# Altium schematic sheet BTB Mezzanine.SchDoc
size A3; SheetNumber: 2; SheetTotal: 11
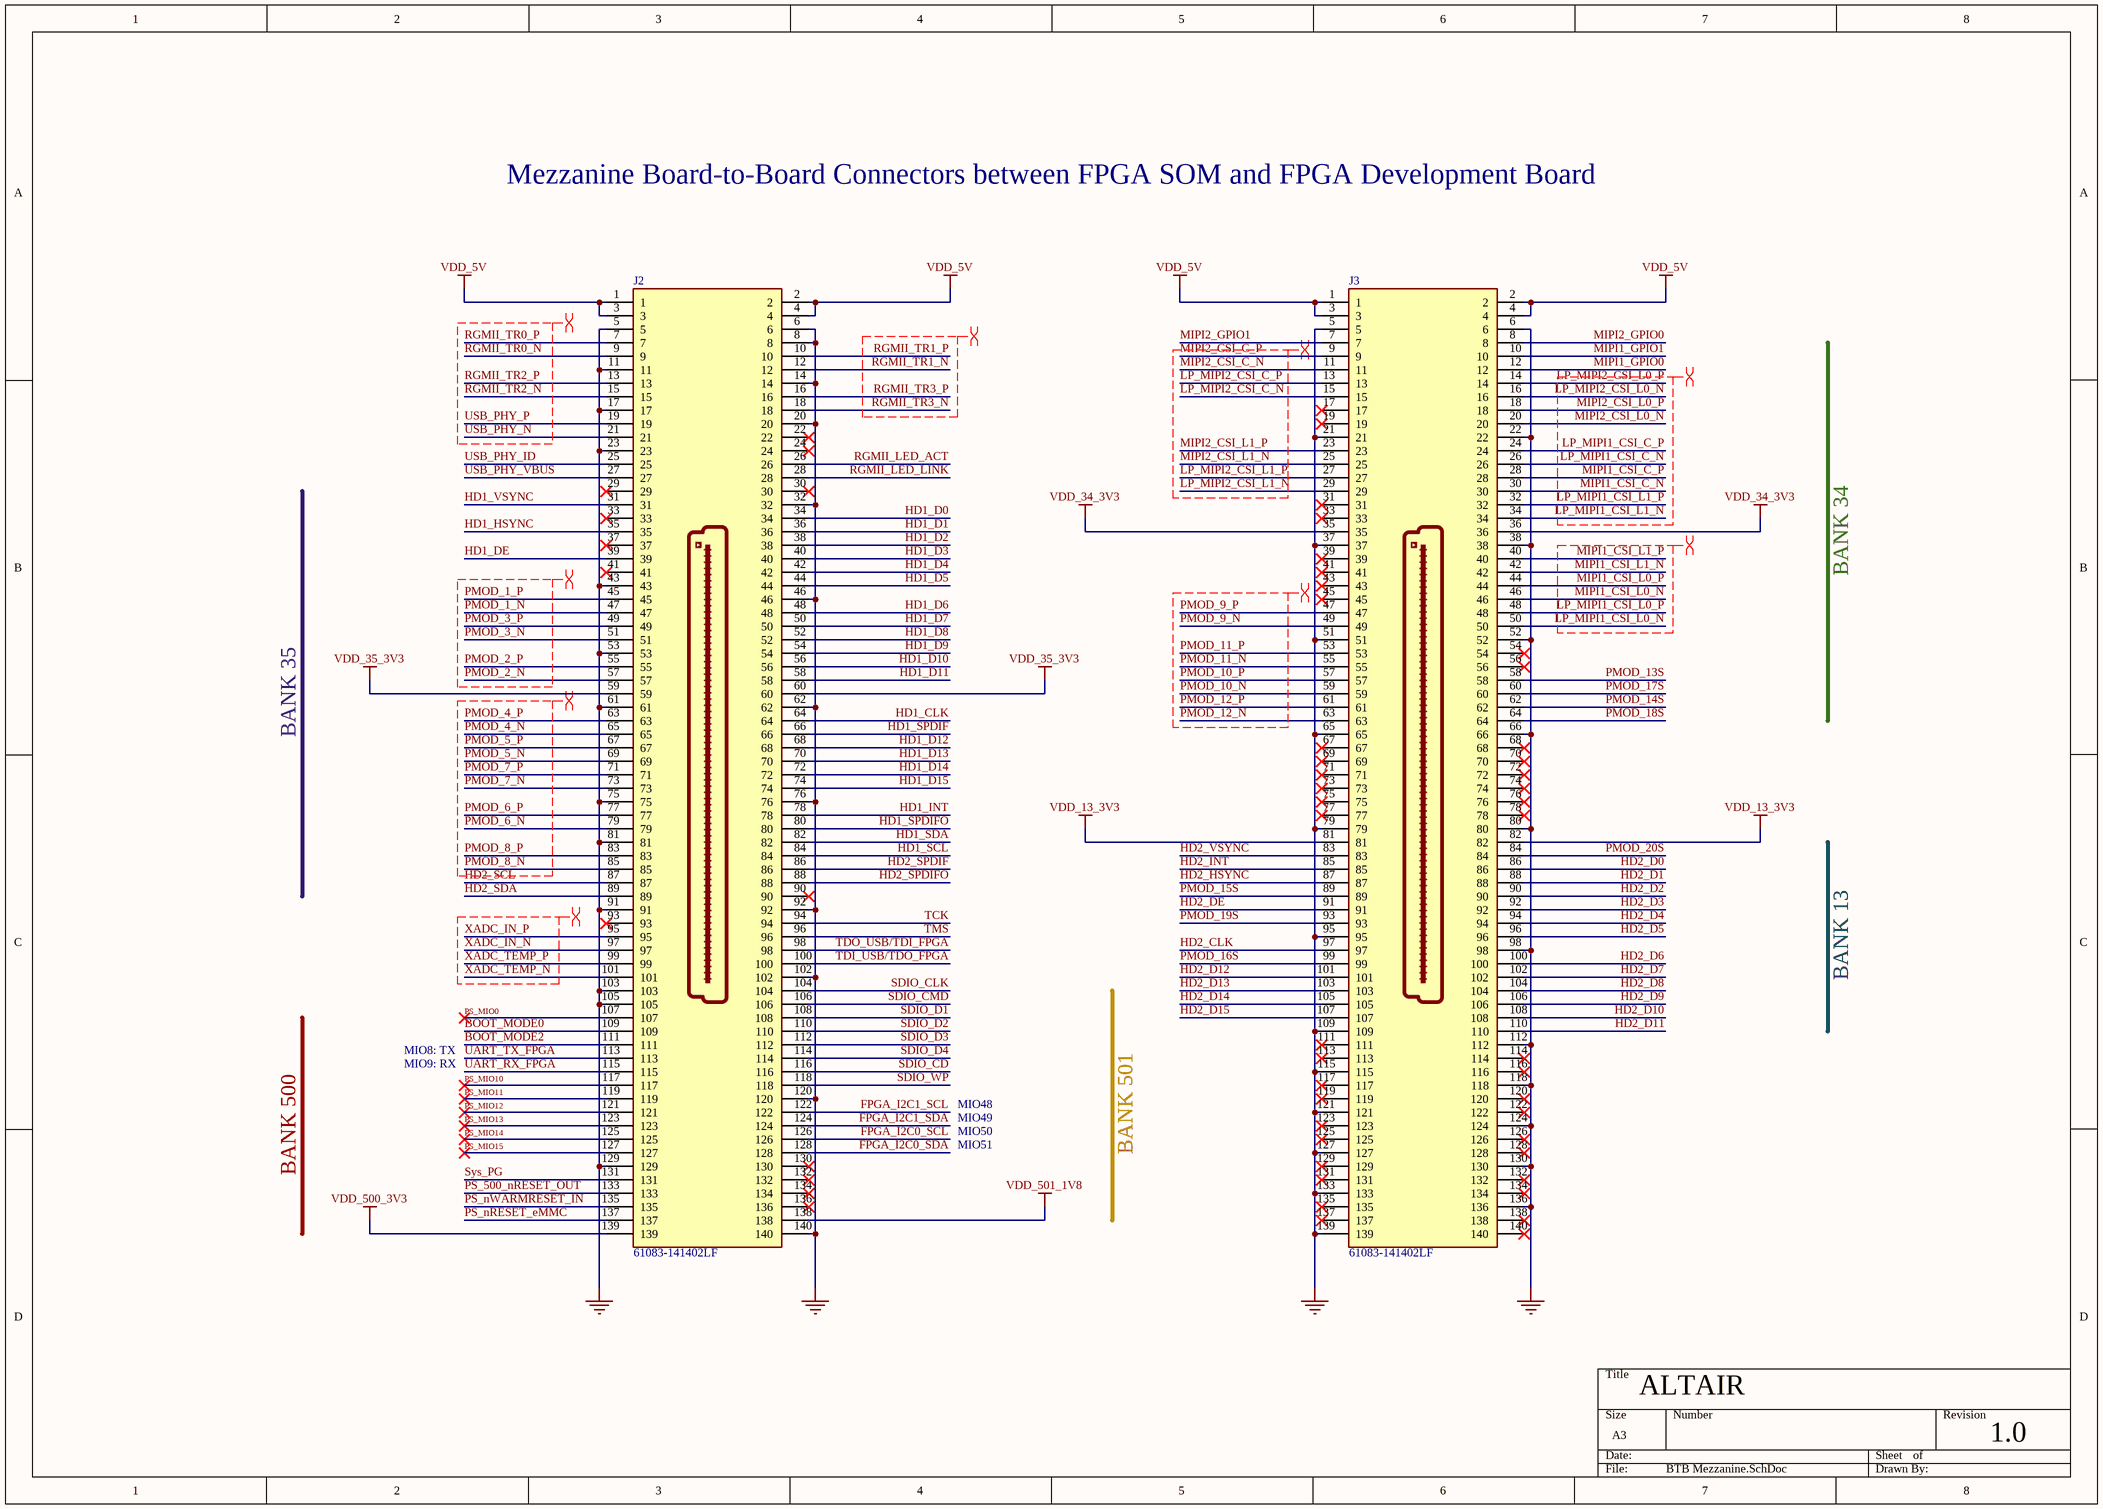
[diagram p0: BTB Mezzanine.SchDoc]

## Parts
J2  61083-141402LF  [61083141402LF]
J3  61083-141402LF  [61083141402LF]

## Nets
GND: J2.5 J2.6 J2.8 J2.11 J2.14 J2.17 J2.20 J2.23 J2.32 J2.43 J2.46 J2.53 J2.61 J2.62 J2.75 J2.76 J2.81 J2.91 J2.92 J2.102 J2.103 J2.105 J2.120 J2.129 J2.140 J3.5 J3.6 J3.21 J3.22 J3.37 J3.38 J3.51 J3.52 J3.65 J3.66 J3.79 J3.80 J3.95 J3.98 J3.109 J3.112 J3.115 J3.118 J3.121 J3.124 J3.127 J3.130 J3.133 J3.136 J3.139
VDD_5V: J2.1 J2.2 J2.3 J2.4 J3.1 J3.2 J3.3 J3.4
VDD_13_3V3: J3.81 J3.82
VDD_34_3V3: J3.35 J3.36
VDD_35_3V3: J2.59 J2.60
VDD_500_3V3: J2.139
VDD_501_1V8: J2.138
BOOT_MODE0: J2.109
BOOT_MODE2: J2.111
FPGA_I2C0_SCL: J2.126
FPGA_I2C0_SDA: J2.128
FPGA_I2C1_SCL: J2.122
FPGA_I2C1_SDA: J2.124
HD1_CLK: J2.64
HD1_D0: J2.34
HD1_D1: J2.36
HD1_D2: J2.38
HD1_D3: J2.40
HD1_D4: J2.42
HD1_D5: J2.44
HD1_D6: J2.48
HD1_D7: J2.50
HD1_D8: J2.52
HD1_D9: J2.54
HD1_D10: J2.56
HD1_D11: J2.58
HD1_D12: J2.68
HD1_D13: J2.70
HD1_D14: J2.72
HD1_D15: J2.74
HD1_DE: J2.39
HD1_HSYNC: J2.35
HD1_INT: J2.78
HD1_SCL: J2.84
HD1_SDA: J2.82
HD1_SPDIF: J2.66
HD1_SPDIFO: J2.80
HD1_VSYNC: J2.31
HD2_CLK: J3.97
HD2_D0: J3.86
HD2_D1: J3.88
HD2_D2: J3.90
HD2_D3: J3.92
HD2_D4: J3.94
HD2_D5: J3.96
HD2_D6: J3.100
HD2_D7: J3.102
HD2_D8: J3.104
HD2_D9: J3.106
HD2_D10: J3.108
HD2_D11: J3.110
HD2_D12: J3.101
HD2_D13: J3.103
HD2_D14: J3.105
HD2_D15: J3.107
HD2_DE: J3.91
HD2_HSYNC: J3.87
HD2_INT: J3.85
HD2_SCL: J2.87
HD2_SDA: J2.89
HD2_SPDIF: J2.86
HD2_SPDIFO: J2.88
HD2_VSYNC: J3.83
LP_MIPI1_CSI_C_N: J3.26
LP_MIPI1_CSI_C_P: J3.24
LP_MIPI1_CSI_L0_N: J3.50
LP_MIPI1_CSI_L0_P: J3.48
LP_MIPI1_CSI_L1_N: J3.34
LP_MIPI1_CSI_L1_P: J3.32
LP_MIPI2_CSI_C_N: J3.15
LP_MIPI2_CSI_C_P: J3.13
LP_MIPI2_CSI_L0_N: J3.16
LP_MIPI2_CSI_L0_P: J3.14
LP_MIPI2_CSI_L1_N: J3.29
LP_MIPI2_CSI_L1_P: J3.27
MIPI1_CSI_C_N: J3.30
MIPI1_CSI_C_P: J3.28
MIPI1_CSI_L0_N: J3.46
MIPI1_CSI_L0_P: J3.44
MIPI1_CSI_L1_N: J3.42
MIPI1_CSI_L1_P: J3.40
MIPI1_GPIO0: J3.12
MIPI1_GPIO1: J3.10
MIPI2_CSI_C_N: J3.11
MIPI2_CSI_C_P: J3.9
MIPI2_CSI_L0_N: J3.20
MIPI2_CSI_L0_P: J3.18
MIPI2_CSI_L1_N: J3.25
MIPI2_CSI_L1_P: J3.23
MIPI2_GPIO0: J3.8
MIPI2_GPIO1: J3.7
PMOD_1_N: J2.47
PMOD_1_P: J2.45
PMOD_2_N: J2.57
PMOD_2_P: J2.55
PMOD_3_N: J2.51
PMOD_3_P: J2.49
PMOD_4_N: J2.65
PMOD_4_P: J2.63
PMOD_5_N: J2.69
PMOD_5_P: J2.67
PMOD_6_N: J2.79
PMOD_6_P: J2.77
PMOD_7_N: J2.73
PMOD_7_P: J2.71
PMOD_8_N: J2.85
PMOD_8_P: J2.83
PMOD_9_N: J3.49
PMOD_9_P: J3.47
PMOD_10_N: J3.59
PMOD_10_P: J3.57
PMOD_11_N: J3.55
PMOD_11_P: J3.53
PMOD_12_N: J3.63
PMOD_12_P: J3.61
PMOD_13S: J3.58
PMOD_14S: J3.62
PMOD_15S: J3.89
PMOD_16S: J3.99
PMOD_17S: J3.60
PMOD_18S: J3.64
PMOD_19S: J3.93
PMOD_20S: J3.84
PS_500_nRESET_OUT: J2.133
PS_MIO0: J2.107
PS_MIO10: J2.117
PS_MIO11: J2.119
PS_MIO12: J2.121
PS_MIO13: J2.123
PS_MIO14: J2.125
PS_MIO15: J2.127
PS_nRESET_eMMC: J2.137
PS_nWARMRESET_IN: J2.135
RGMII_LED_ACT: J2.26
RGMII_LED_LINK: J2.28
RGMII_TR0_N: J2.9
RGMII_TR0_P: J2.7
RGMII_TR1_N: J2.12
RGMII_TR1_P: J2.10
RGMII_TR2_N: J2.15
RGMII_TR2_P: J2.13
RGMII_TR3_N: J2.18
RGMII_TR3_P: J2.16
SDIO_CD: J2.116
SDIO_CLK: J2.104
SDIO_CMD: J2.106
SDIO_D1: J2.108
SDIO_D2: J2.110
SDIO_D3: J2.112
SDIO_D4: J2.114
SDIO_WP: J2.118
Sys_PG: J2.131
TCK: J2.94
TDI_USB/TDO_FPGA: J2.100
TDO_USB/TDI_FPGA: J2.98
TMS: J2.96
UART_RX_FPGA: J2.115
UART_TX_FPGA: J2.113
USB_PHY_ID: J2.25
USB_PHY_N: J2.21
USB_PHY_P: J2.19
USB_PHY_VBUS: J2.27
XADC_IN_N: J2.97
XADC_IN_P: J2.95
XADC_TEMP_N: J2.101
XADC_TEMP_P: J2.99

Not connected (* = marked no-connect by the designer): J2 22* 24* 29* 30* 33* 37* 41* 90* 93* 130* 132* 134* 136*; J3 17* 19* 31* 33* 39* 41* 43* 45* 54* 56* 67* 68* 69* 70* 71* 72* 73* 74* 75* 76* 77* 78* 111* 113* 114* 116* 117* 119* 120* 122* 123* 125* 126* 128* 129* 131* 132* 134* 135* 137* 138* 140*

## Layout directives
differential pair: LP_MIPI1_CSI_C_N, LP_MIPI1_CSI_C_P, LP_MIPI1_CSI_L0_N, LP_MIPI1_CSI_L0_P, LP_MIPI1_CSI_L1_N, LP_MIPI1_CSI_L1_P, LP_MIPI2_CSI_C_N, LP_MIPI2_CSI_C_P, LP_MIPI2_CSI_L0_N, LP_MIPI2_CSI_L0_P, LP_MIPI2_CSI_L1_N, LP_MIPI2_CSI_L1_P, MIPI1_CSI_C_N, MIPI1_CSI_C_P, MIPI1_CSI_L0_N, MIPI1_CSI_L0_P, MIPI1_CSI_L1_N, MIPI1_CSI_L1_P, MIPI2_CSI_C_N, MIPI2_CSI_C_P, MIPI2_CSI_L0_N, MIPI2_CSI_L0_P, MIPI2_CSI_L1_N, MIPI2_CSI_L1_P, PMOD_1_N, PMOD_1_P, PMOD_2_N, PMOD_2_P, PMOD_3_N, PMOD_3_P, PMOD_4_N, PMOD_4_P, PMOD_5_N, PMOD_5_P, PMOD_6_N, PMOD_6_P, PMOD_7_N, PMOD_7_P, PMOD_8_N, PMOD_8_P, PMOD_9_N, PMOD_9_P, PMOD_10_N, PMOD_10_P, PMOD_11_N, PMOD_11_P, PMOD_12_N, PMOD_12_P, RGMII_TR0_N, RGMII_TR0_P, RGMII_TR1_N, RGMII_TR1_P, RGMII_TR2_N, RGMII_TR2_P, RGMII_TR3_N, RGMII_TR3_P, USB_PHY_N, USB_PHY_P, XADC_IN_N, XADC_IN_P, XADC_TEMP_N, XADC_TEMP_P

## Notes on the sheet
- Mezzanine Board-to-Board Connectors between FPGA SOM and FPGA Development Board
- BANK 34
- BANK 35
- BANK 13
- MIO8: TX
- MIO9: RX
- MIO49
- MIO48
- BANK 500
- MIO51
- MIO50
- BANK 501
- ALTAIR
- 1.0

## Library data of the parts
J2 J3 = 61083-141402LF: Connector; JLCPCB Part #: C5338666; Part No: 61083-141402LF; Footprint JLCPCB: SMD,P=0.8mm; Note/Misc: *